# Altium schematic sheet Other.SchDoc: Iris
size A3; Organization: Toradex AG; Address1: Altsagenstrasse 5; Address2: Horw; Address3: 6048; Address4: Switzerland; DocumentNumber: 13; Revision: V2.0; SheetNumber: 13; SheetTotal: 16
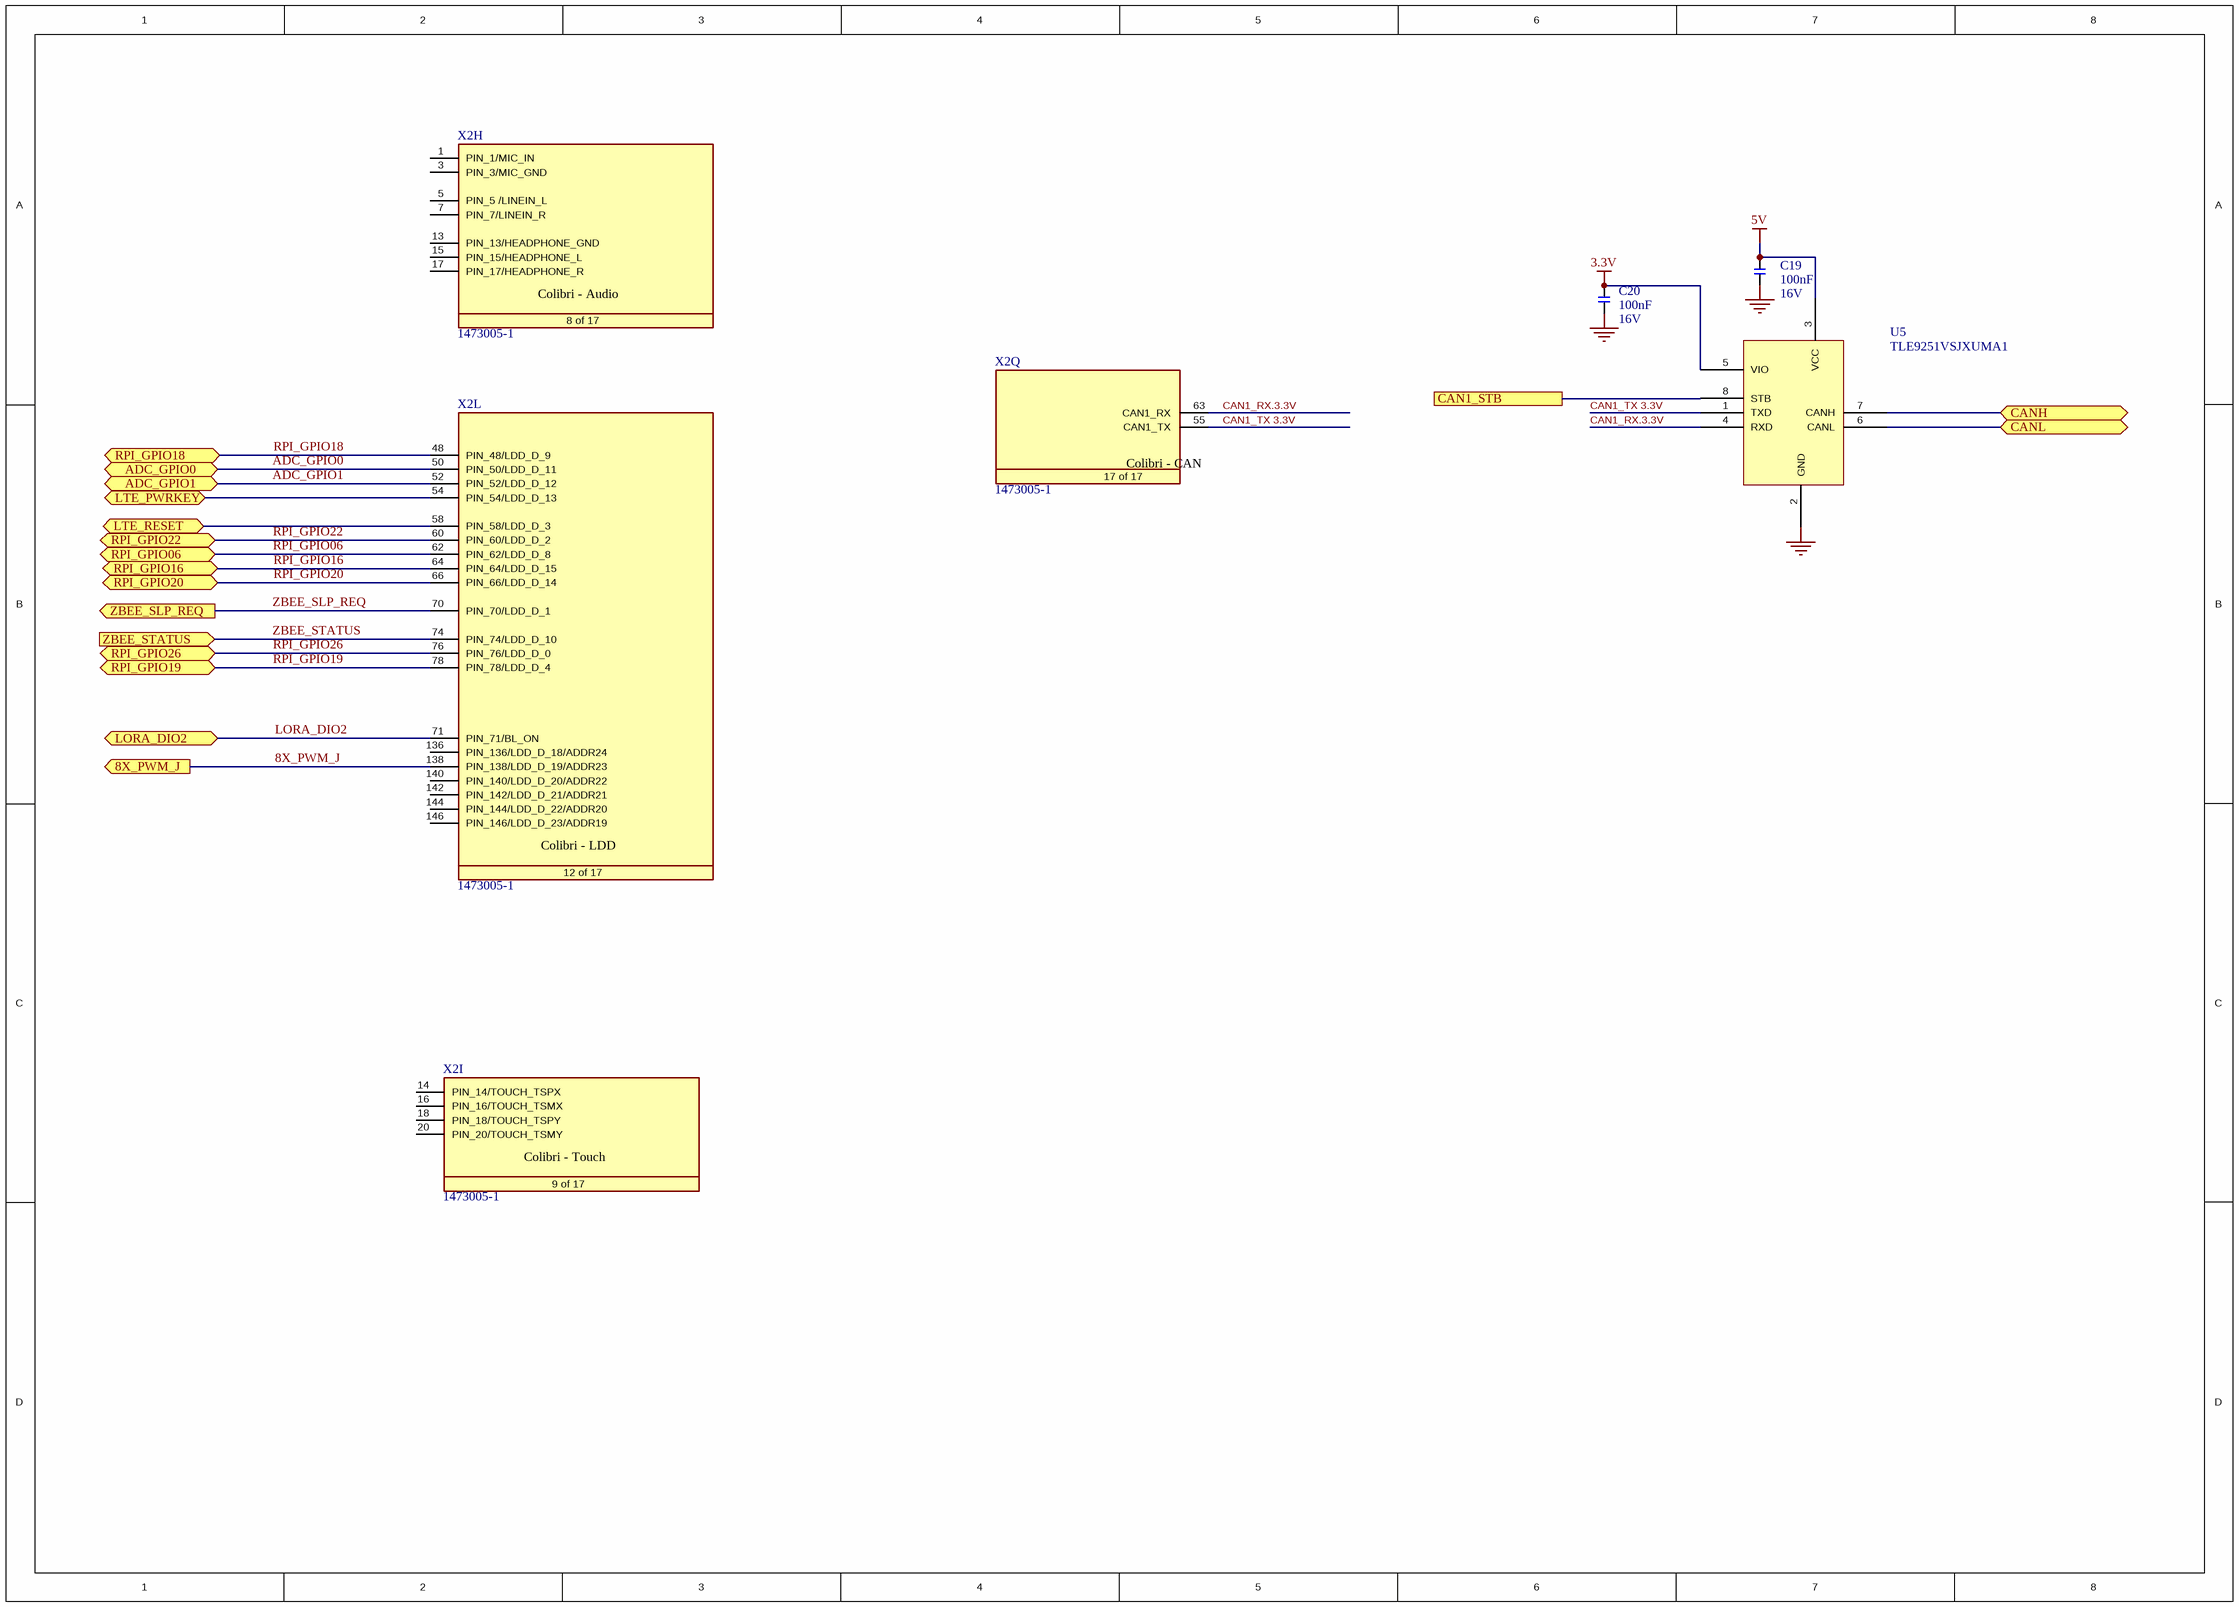
[diagram p0: Other.SchDoc]

## Parts
C19  Rating: 16V  [T_CAPC0603X33N]  (hidden comment: 100nF)
C20  Rating: 16V  [T_CAPC0603X33N]  (hidden comment: 100nF)
U5  TLE9251VSJXUMA1  [SOIC127P602X173-8N]
X2  1473005-1  [T_Tyco_1473005-1]  (parts H,I,L,Q of 17)

## Ports
8X_PWM_J (out), ADC_GPIO0 (bidir), ADC_GPIO1 (bidir), CAN1_STB, CANH (bidir), CANL (bidir), LORA_DIO2 (bidir), LTE_PWRKEY (bidir), LTE_RESET (bidir), RPI_GPIO06 (bidir), RPI_GPIO16 (bidir), RPI_GPIO18 (bidir), RPI_GPIO19 (bidir), RPI_GPIO20 (bidir), RPI_GPIO22 (bidir), RPI_GPIO26 (bidir), ZBEE_SLP_REQ (out), ZBEE_STATUS (in)

## Nets
3.3V: C20.2 U5.5(VIO)
5V: C19.2 U5.3(VCC)
GND: C19.1 C20.1 U5.2(GND)
8X_PWM_J: X2.138(PIN_138/LDD_D_19/ADDR23) ; port 8X_PWM_J
ADC_GPIO0: X2.50(PIN_50/LDD_D_11) ; port ADC_GPIO0
ADC_GPIO1: X2.52(PIN_52/LDD_D_12) ; port ADC_GPIO1
CAN1_RX.3.3V: U5.4(RXD) X2.63(CAN1_RX)
CAN1_STB: U5.8(STB) ; port CAN1_STB
CAN1_TX 3.3V: U5.1(TXD) X2.55(CAN1_TX)
CANH: U5.7(CANH) ; port CANH
CANL: U5.6(CANL) ; port CANL
LORA_DIO2: X2.71(PIN_71/BL_ON) ; port LORA_DIO2
LTE_PWRKEY: X2.54(PIN_54/LDD_D_13) ; port LTE_PWRKEY
LTE_RESET: X2.58(PIN_58/LDD_D_3) ; port LTE_RESET
RPI_GPIO06: X2.62(PIN_62/LDD_D_8) ; port RPI_GPIO06
RPI_GPIO16: X2.64(PIN_64/LDD_D_15) ; port RPI_GPIO16
RPI_GPIO18: X2.48(PIN_48/LDD_D_9) ; port RPI_GPIO18
RPI_GPIO19: X2.78(PIN_78/LDD_D_4) ; port RPI_GPIO19
RPI_GPIO20: X2.66(PIN_66/LDD_D_14) ; port RPI_GPIO20
RPI_GPIO22: X2.60(PIN_60/LDD_D_2) ; port RPI_GPIO22
RPI_GPIO26: X2.76(PIN_76/LDD_D_0) ; port RPI_GPIO26
ZBEE_SLP_REQ: X2.70(PIN_70/LDD_D_1) ; port ZBEE_SLP_REQ
ZBEE_STATUS: X2.74(PIN_74/LDD_D_10) ; port ZBEE_STATUS

Not connected (* = marked no-connect by the designer): X2 1(PIN_1/MIC_IN) 3(PIN_3/MIC_GND) 5(PIN_5_/LINEIN_L) 7(PIN_7/LINEIN_R) 13(PIN_13/HEADPHONE_GND) 14(PIN_14/TOUCH_TSPX) 15(PIN_15/HEADPHONE_L) 16(PIN_16/TOUCH_TSMX) 17(PIN_17/HEADPHONE_R) 18(PIN_18/TOUCH_TSPY) 20(PIN_20/TOUCH_TSMY) 136(PIN_136/LDD_D_18/ADDR24) 140(PIN_140/LDD_D_20/ADDR22) 142(PIN_142/LDD_D_21/ADDR21) 144(PIN_144/LDD_D_22/ADDR20) 146(PIN_146/LDD_D_23/ADDR19)

## Notes on the sheet
- Title
- Size:
- Date:
- A3
- Number:
- Time:
- Revision:
- Sheet
- of
- File:
- (in symbol CON-Tyco-1473005-1-200-0.6mm, part H) Colibri - Audio; 8 of 17
- (in symbol CON-Tyco-1473005-1-200-0.6mm, part I) Colibri - Touch; 9 of 17
- (in symbol CON-Tyco-1473005-1-200-0.6mm, part L) Colibri - LDD; 12 of 17
- (in symbol CON-Tyco-1473005-1-200-0.6mm, part Q) Colibri - CAN; 17 of 17

## Library data of the parts
C19 C20 = C-X7R-100nF-16V-10%-0603: Capacitor Ceramic X7R 100nF 16V 10% 0603; Tolerance: 10%; Type: X7R; Value: 100nF
X2 = CON-Tyco-1473005-1-200-0.6mm: SODIMM Connector; Manufacturer Name: Tyco; No. of ways: 200; Manufacturer Part No.: 1473005-1